# Altium schematic sheet HV_power.SchDoc
size A4; SheetNumber: 5; SheetTotal: 6
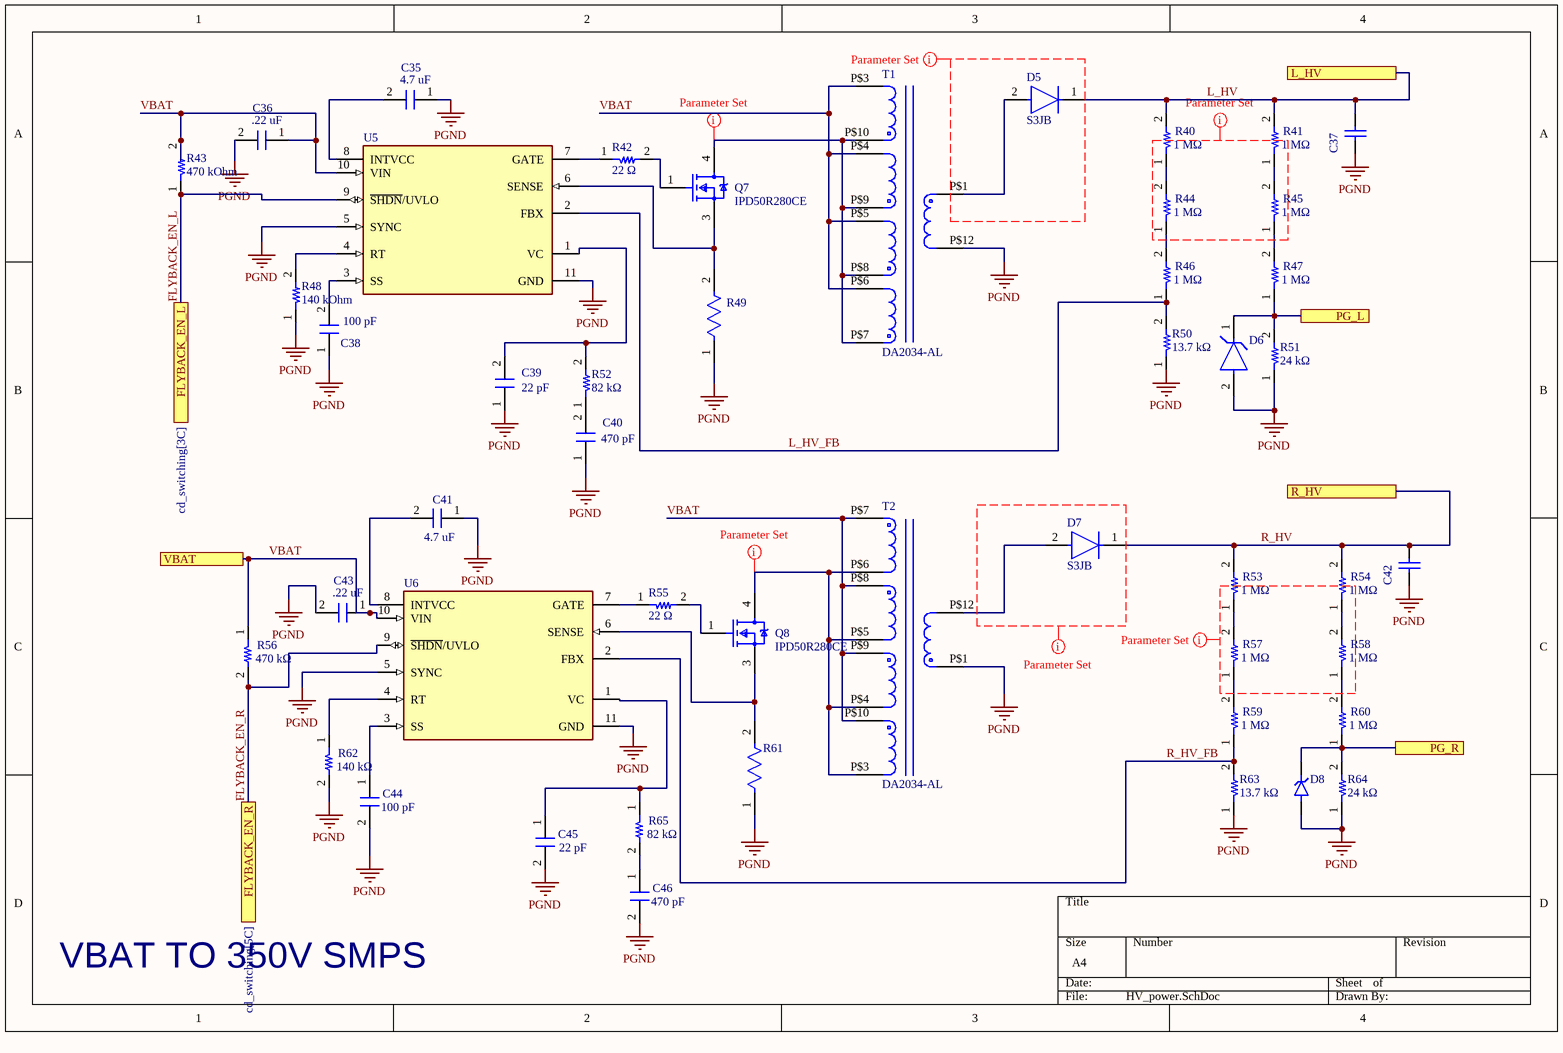
[diagram p0: HV_power.SchDoc]

## Parts
C35  value 4.7 uF  [0603_FP]  (hidden comment: GRM21BR61C475KA88L)
C36  value .22 uF  [0603_FP]  (hidden comment: GRM21BR61C475KA88L)
C37  890283323005CS  [WCAP-FTBP_L13W5.5H11]  (value not drawn)
C38  value 100 pF  [0603_FP]  (hidden comment: Capacitor_0603)
C39  value 22 pF  [0603_FP]  (hidden comment: Capacitor_0603)
C40  value 470 pF  [0603_FP]  (hidden comment: Capacitor_0603)
C41  value 4.7 uF  [0603_FP]  (hidden comment: Capacitor_0603)
C42  890283323005CS  [WCAP-FTBP_L13W5.5H11]  (value not drawn)
C43  value .22 uF  [0603_FP]  (hidden comment: GRM21BR61C475KA88L)
C44  value 100 pF  [0603_FP]  (hidden comment: Capacitor_0603)
C45  value 22 pF  [0603_FP]  (hidden comment: Capacitor_0603)
C46  value 470 pF  [0603_FP]  (hidden comment: Capacitor_0603)
D5  S3JB  [FP-403AF-MFG]
D6  CZRQR3V3B-HF  [FP-0402-SOD-923F-MFG]  (value not drawn)
D7  S3JB  [FP-403AF-MFG]
D8  BZT52B15SH_RRG  [DIO_BZT52B15SH_RRG]  (value not drawn)
Q7  IPD50R280CE  [FP-PG-TO252-3-MFG]
Q8  IPD50R280CE  [FP-PG-TO252-3-MFG]
R40  value 1 MΩ  [0805_FP]  (hidden comment: R_0805)
R41  value 1 MΩ  [0805_FP]  (hidden comment: R_0805)
R42  value 22 Ω  [0603_FP]  (hidden comment: Resistor_0603)
R43  value 470 kOhm  [0603_FP]  (hidden comment: Resistor_0603)
R44  value 1 MΩ  [0805_FP]  (hidden comment: R_0805)
R45  value 1 MΩ  [0805_FP]  (hidden comment: R_0805)
R46  value 1 MΩ  [0805_FP]  (hidden comment: R_0805)
R47  value 1 MΩ  [0805_FP]  (hidden comment: R_0805)
R48  value 140 kOhm  [0603_FP]  (hidden comment: Resistor_0603)
R49  CSRN2010FK20L0  [FP-CSRN2010-IPC_B]  (value not drawn)
R50  value 13.7 kΩ  [0805_FP]  (hidden comment: R_0805)
R51  value 24 kΩ  [0805_FP]  (hidden comment: R_0805)
R52  value 82 kΩ  [0603_FP]  (hidden comment: Resistor_0603)
R53  value 1 MΩ  [0805_FP]  (hidden comment: R_0805)
R54  value 1 MΩ  [0805_FP]  (hidden comment: R_0805)
R55  value 22 Ω  [0603_FP]  (hidden comment: Resistor_0603)
R56  value 470 kΩ  [0603_FP]  (hidden comment: Resistor_0603)
R57  value 1 MΩ  [0805_FP]  (hidden comment: R_0805)
R58  value 1 MΩ  [0805_FP]  (hidden comment: R_0805)
R59  value 1 MΩ  [0805_FP]  (hidden comment: R_0805)
R60  value 1 MΩ  [0805_FP]  (hidden comment: R_0805)
R61  CSRN2010FK20L0  [FP-CSRN2010-IPC_B]  (value not drawn)
R62  value 140 kΩ  [0603_FP]  (hidden comment: Resistor_0603)
R63  value 13.7 kΩ  [0805_FP]  (hidden comment: R_0805)
R64  value 24 kΩ  [0805_FP]  (hidden comment: R_0805)
R65  value 82 kΩ  [0603_FP]  (hidden comment: Resistor_0603)
T1  DA2034-AL  [DA2034-AL]
T2  DA2034-AL  [DA2034-AL]
U5  LT3758EDD#PBF  [FP-DD-10-05-08-1699-IPC_B]  (value not drawn)
U6  LT3758EDD#PBF  [FP-DD-10-05-08-1699-IPC_B]  (value not drawn)

## Ports
FLYBACK_EN_L (see cd_switching[3C]), FLYBACK_EN_R (see cd_switching[5C]), L_HV (see cd_switching[4A]), PG_L (see logic[3B]), PG_R (see logic[3B]), R_HV (see cd_switching[6B]), VBAT (see cd_switching[3A], cd_switching[3B], input_output[2D], LV_power[1B])

## Nets
PGND: C35.1 C36.2 C37.1 C38.1 C39.1 C40.1 C41.1 C42.1 C43.2 C44.2 C45.2 C46.2 D6.2(A) D8.2(A) R48.1 R49.1 R50.1 R51.1 R61.1 R62.2 R63.1 R64.1 T1.P$12 T2.P$1 U5.5(SYNC) U5.11(GND) U6.5(SYNC) U6.11(GND)
FLYBACK_EN_L: R43.1 U5.9(~{SHDN}/UVLO) ; port FLYBACK_EN_L
FLYBACK_EN_R: R56.2 U6.9(~{SHDN}/UVLO) ; port FLYBACK_EN_R
L_HV: C37.2 D5.1(C) R40.2 R41.2 ; port L_HV
L_HV_FB: R46.1 R50.2 U5.2(FBX)
PG_L: D6.1(C) R47.1 R51.2 ; port PG_L
PG_R: D8.1(K) R60.1 R64.2 ; port PG_R
R_HV: C42.2 D7.1(C) R53.2 R54.2 ; port R_HV
R_HV_FB: R59.1 R63.2 U6.2(FBX)
VBAT: C36.1 C43.1 R43.2 R56.1 T1.P$3 T1.P$4 T1.P$5 T1.P$6 T2.P$7 T2.P$8 T2.P$9 T2.P$10 U5.10(VIN) U6.10(VIN) ; port VBAT
NetC35_2: C35.2 U5.8(INTVCC)
NetC38_2: C38.2 U5.3(SS)
NetC39_2: C39.2 R52.2 U5.1(VC)
NetC40_2: C40.2 R52.1
NetC41_2: C41.2 U6.8(INTVCC)
NetC44_1: C44.1 U6.3(SS)
NetC45_1: C45.1 R65.1 U6.1(VC)
NetC46_1: C46.1 R65.2
NetD5_2: D5.2(A) T1.P$1
NetD7_2: D7.2(A) T2.P$12
NetQ7_1: Q7.1(GATE) R42.2
NetQ7_3: Q7.3(SOURCE) R49.2 U5.6(SENSE)
NetQ7_4: Q7.4(DRAIN) T1.P$7 T1.P$8 T1.P$9 T1.P$10
NetQ8_1: Q8.1(GATE) R55.2
NetQ8_3: Q8.3(SOURCE) R61.2 U6.6(SENSE)
NetQ8_4: Q8.4(DRAIN) T2.P$3 T2.P$4 T2.P$5 T2.P$6
NetR40_1: R40.1 R44.2
NetR41_1: R41.1 R45.2
NetR42_1: R42.1 U5.7(GATE)
NetR44_1: R44.1 R46.2
NetR45_1: R45.1 R47.2
NetR48_2: R48.2 U5.4(RT)
NetR53_1: R53.1 R57.2
NetR54_1: R54.1 R58.2
NetR55_1: R55.1 U6.7(GATE)
NetR57_1: R57.1 R59.2
NetR58_1: R58.1 R60.2
NetR62_1: R62.1 U6.4(RT)

## Layout directives
net class HV_NETS: (no net found under the mark), NetQ7_4, NetQ8_4
net class FB_NETS: (no net found under the mark)

## Notes on the sheet
- VBAT TO 350V SMPS

## Library data of the parts
C35 C36 C38-C41 C43-C46 = Capacitor_0603: Format: 0402; Package: 0402
C37 C42 = CMP-03913-89437304-2: Cap, 0.1Uf, 400V, Film, Radial Rohs Compliant: Yes; Capacitance: 100nF; ESR (Equivalent Series Resistance): 38.46mΩ; Insulation Resistance: 30GΩ; Pin Length: 4mm; Pitch: 10mm; Height: 11mm; Width: 5.5mm; Length: 13mm; RoHS: Compliant; Voltage Rating: 400V; Packaging: Carton
D5 D7 = CMP-00278-84331306-1: S3JB Rectifier Diode, 1 Phase, 1 Element, 3A, 600V V(RRM), Silicon, DO-214AA; Manufacturer Lifecycle Status: ACTIVE; Element Configuration: Single; Max Junction Temperature (Tj): 150°C; Peak Reverse Current: 10µA; Capacitance: 40pF; Reverse Recovery Time: 1.5µs; Max Forward Surge Current (Ifsm): 80A; Mount: Surface Mount; Max Reverse Voltage (DC): 600V; RoHS: Compliant; Packaging: Cut Tape; Weight: 180mg; Schedule B: 8541100080, 8541100080; Average Rectified Current: 3A; Height: 2.65mm; Min Operating Temperature: -55°C; Reverse Voltage: 600V; Max Repetitive Reverse Voltage (Vrrm): 600V; Lifecycle Status: Production; Case/Package: SMB; Forward Current: 3A; Max Operating Temperature: 150°C; NexarPartId: 84331306
D6 = CMP-20229-000002-1: DIODE ZENER 3.3V 125MW 0402; Element Configuration: Single; Max Reverse Leakage Current: 25uA; Tolerance: 5%; Zener Current: 5mA; Impedance: 95R; Mount: Surface Mount; Case Code (Metric): 1006; Packaging: Cut Tape; Max Power Dissipation: 125mW; Case Code (Imperial): 0402; Power Dissipation: 125mW; Zener Voltage: 3.3V; Package Quantity: 5000; Min Operating Temperature: -55°C; Max Operating Temperature: 125°C; Case/Package: 0402
D8 = BZT52B15SH_RRG: SOD-323, 200mW, 2%, 15V, Zener Diode; MF: Taiwan Semiconductor Corporation; MP: BZT52B15SH RRG; SnapEDA_Link: https://www.snapeda.com/parts/BZT52B15SH%20RRG/Taiwan+Semiconductor+Corporation/view-part/?ref=snap; Package: SOD-323-2 Taiwan Semiconductor; Value: *; Check_prices: https://www.snapeda.com/parts/BZT52B15SH%20RRG/Taiwan+Semiconductor+Corporation/view-part/?ref=eda
Q7 Q8 = CMP-32901-000143-1: MOSFET N-CH 30V 161A DPAK; Manufacturer Part Number: IRLR7843TRPBF; Manufacturer: Infineon; Drain To Source Resistance: 3.2mΩ; Depletion Mode: False; Reverse Recovery Time: 39ns; Reverse Recovery Charge: 36nC; Threshold Vgs Max: 2.3V; Rthja Max: 50°C/W; Threshold Vgs Min: 1.4V; Power Dissipation: 140W; Pulse Drain Current: 620A; Input Capacitace At Vds: 4380pF @ 15V; Turn On Delay Time: 25ns; Gate To Source Voltage: 20V; Max Forward Diode Voltage: 1V; Gate Charge At Vgs: 34nC @ 4.5V; Max Junction Temp: +175°C; Number Of Channels: 1; Turn Off Delay Time: 34ns; ComponentLink2URL: https://www.infineon.com/dgdl/irlr7843pbf.pdf?fileId=5546d462533600a40153566de53526d8; Temperature Range High: +175°C; Octopart: https://octopart.com/irlr7843trpbf-infineon-65875062; Temperature: -55°C to +175°C; Device Class L3: MOSFETs; Category: Trans; Package: PG-TO252-3; Footprint Url: https://www.infineon.com/cms/en/product/packages/PG-TO252/PG-TO252-3-901/; Continuous Drain Current: 161A; Digikey Description: MOSFET N-CH 30V 161A DPAK; Automotive: No; Lead Free: Yes; Drain To Source Breakdown Voltage: 30V; Height: 2.52mm; Temperature Range Low: -55°C; RoHS: TRUE; Number Of N Channels: 1; Drain To Source Voltage: 30V; ComponentLink2Description: Datasheet; Device Class L2: Transistors; Device Class L1: Discrete Semiconductors
R42 R43 R48 R52 R55 R56 R62 R65 = Resistor_0603: Format: 0402; Package: 0402
R49 R61 = CMP-26527-002648-1: Res Thick Film 2010 20mΩ 1% 1W ±250ppm/°C Molded SMD Plastic T/R; Resistance: 12 mΩ; Number of Terminations: 2; Radiation Hardening: No; Series: CSRN; Length: 0.197inch; RoHS Compliant: Yes; Max Operating Temperature: 155°C; Packaging: Tape and Reel; Resistor Type: Thick Film; Tolerance: 1%; Mount: Surface Mount; Height: 0.03inch; Package Quantity: 1; Case Code (Imperial): 2010; Case Code (Metric): 5025; Max Power Dissipation: 1W; Temperature Coefficient: 250ppm/°C; Case/Package: 2010; Size Code: 2010; Width: 0.097inch; Contact Plating: Tin; Power Rating: 1W; Min Operating Temperature: -55°C; Lead Free: Lead Free
T1 T2 = DA2034-AL: Flyback Transformer for Linear Technology LT3750  Reference: http://www.coilcraft.com/da2032.cfm  L - 10 uH TurnsRatio Pri:Sec - 1:10 Ipeak - 10.0 A Interwinding capacitance - 128 pF DCRmax: Pri - 0.018, Sec - 1.75 Ohms; Package: None; Price: None; Value: *; MP: DA2034-AL; Availability: Unavailable
U5 U6 = CMP-09139-000585-1: IC REG CTRLR MULT TOPOLOGY 10DFN; Max Input Voltage: 100V; Number of Outputs: 1; Max Output Voltage: 12V; Max Output Current: 1.2A; Max Frequency: 1MHz; Min Input Voltage: 5.5V; Topology: Boost; Mount: Surface Mount; Min Operating Temperature: -40°C; REACH SVHC: No SVHC; Max Operating Temperature: 125°C; Output Voltage: 100V; Max Supply Voltage: 100V; Switching Frequency: 1MHz; Case/Package: DFN; Package Quantity: 121; Series: -; Packaging: Rail/Tube; RoHS Compliant: Yes; Width: 3mm; Min Supply Voltage: 5.5V; Number of Pins: 10; Length: 3mm; Height: 0.7mm